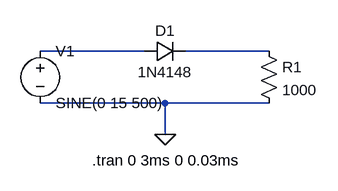
[diagram p0: schematic Halfwave_Rectifier.asc]
Halfwave_Rectifier.asc, the LTspice schematic file:
Version 4
SHEET 1 880 680
WIRE 144 112 -16 112
WIRE 336 112 208 112
WIRE 176 192 -16 192
WIRE 336 192 176 192
WIRE 176 240 176 192
FLAG 176 240 0
SYMBOL diode 144 128 R270
WINDOW 0 32 32 VTop 2
WINDOW 3 0 32 VBottom 2
SYMATTR InstName D1
SYMATTR Value 1N4148
SYMBOL voltage -16 96 R0
WINDOW 123 0 0 Left 0
WINDOW 39 0 0 Left 0
SYMATTR InstName V1
SYMATTR Value SINE(0 15 500)
SYMBOL res 320 96 R0
SYMATTR InstName R1
SYMATTR Value 1000
TEXT 64 280 Left 2 !.tran 0 3ms 0 0.03ms

The netlist it stands for:
* Halfwave_Rectifier.asc
D1 N001 N002 1N4148
V1 N001 0 SINE(0 15 500)
R1 N002 0 1000
.model D D
.lib standard.dio
.tran 0 3ms 0 0.03ms
.backanno
.end